# Altium schematic sheet schematic.SchDoc
size A; SheetNumber: 1; SheetTotal: 1
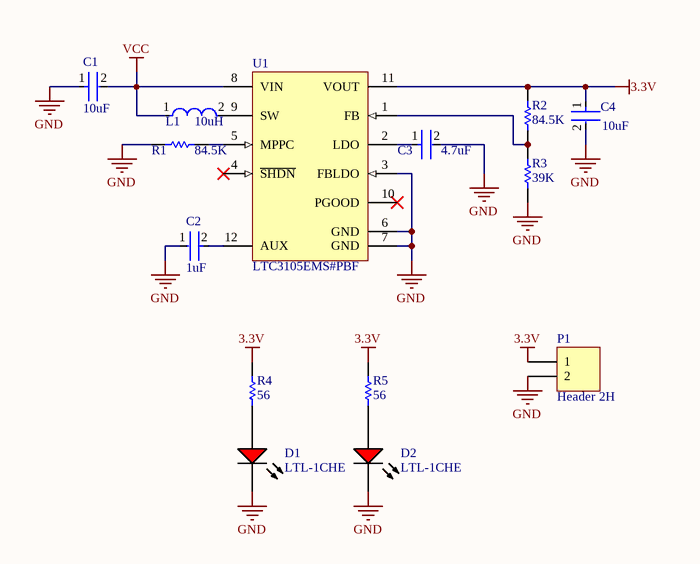
[diagram p0: schematic.SchDoc]

## Parts
C1  10uF  [FP-GRM188-0_1-e0_2_0_55-IPC_A]
C2  1uF  [FP-C1608-080-0_1-IPC_B]
C3  4.7uF  [FP-GRM188-0_15-IPC_C]
C4  10uF  [FP-GRM188-0_1-e0_2_0_55-IPC_A]
D1  LTL-1CHE  [INDPR60-254-520X380X650]
D2  LTL-1CHE  [INDPR60-254-520X380X650]
L1  10uH  [FP-NR6028-MFG]
P1  Header 2H  [HDR1X2H]
R1  84.5K  [RESC1608X55X30LL15T15]
R2  84.5K  [RESC1608X55X30LL15T15]
R3  39K  [RESC1608X55X25LL10T15]
R4  56  [RESC1608X55X30NL15T15]
R5  56  [RESC1608X55X30NL15T15]
U1  LTC3105EMS#PBF  [LT-MS-12_N]

## Nets
3.3V: C4.1 P1.1 R2.2 R4.1 R5.1 U1.11(VOUT)
GND: C1.1 C2.1 C3.2 C4.2 D1.2(K) D2.2(K) P1.2 R1.1 R3.2 U1.3(FBLDO) U1.6(GND) U1.7(GND)
VCC: C1.2 L1.1 U1.8(VIN)
NetC2_2: C2.2 U1.12(AUX)
NetC3_1: C3.1 U1.2(LDO)
NetD1_1: D1.1(A) R4.2
NetD2_1: D2.1(A) R5.2
NetL1_2: L1.2 U1.9(SW)
NetR1_2: R1.2 U1.5(MPPC)
NetR2_1: R2.1 R3.1 U1.1(FB)

Not connected (* = marked no-connect by the designer): U1 4(~{SHDN})* 10(PGOOD)*

## Library data of the parts
C1 C4 = CMP-2006-02792-2: Chip Multilayer Ceramic Capacitors for General Purpose, 0603, 10uF, X5R, 15%, 20%, 6.3V; Packaging: Tape and Reel; Voltage Rating (DC): 6.3V; Width: 0.031inch; Termination: SMD/SMT; Dielectric: X5R; Package Quantity: 4000; Voltage Rating: 6.3V; Capacitance: 10uF; Case/Package: 0603; Min Operating Temperature: -55°C; Voltage: 6.3V; Length: 1.6mm; Thickness: 0.035inch; Lead Free: Lead Free; Depth: 0.8mm; Case Code (Imperial): 0603; Max Operating Temperature: 85°C; Material: Ceramic; Height: 0.8mm; Tolerance: 20%; Mount: Surface Mount; REACH SVHC: No SVHC; Radiation Hardening: No; Case Code (Metric): 1608
C2 = CMP-2000-06025-2: Multilayer Ceramic Capacitors 1μF ±10% 50V X5R SMD 0603; Lead Free: Lead Free; Height: 0.8mm; Mount: Surface Mount; Radiation Hardening: No; Thickness: 0.035inch; Length: 1.6mm; Max Operating Temperature: 85°C; REACH SVHC: No SVHC; Min Operating Temperature: -55°C; Construction: Flat; RoHS Compliant: Yes; Voltage Rating: 50V; Dielectric: X5R; Packaging: Tape and Reel; Termination: SMD/SMT; Voltage Rating (DC): 50V; Case Code (Imperial): 0603; Voltage: 50V; Width: 0.031inch; Weight: 7.1E-05oz; Capacitance: 1uF; Depth: 0.8mm; Case Code (Metric): 1608; Series: C; Case/Package: 0603; Tolerance: 10%; Resistor Type: Ceramic; Number of Pins: 2; Dielectric Material: Ceramic; Package Quantity: 1
C3 = CMP-2006-02523-2: Chip Multilayer Ceramic Capacitors for General Purpose, 0603, 4.7uF, X5R, 15%, 10%, 25V; Case Code (Metric): 1608; Max Operating Temperature: 85°C; REACH SVHC: No SVHC; Voltage Rating: 25V; Dielectric: X5R; Packaging: Cut Tape; Width: 0.031inch; Min Operating Temperature: -55°C; Lead Free: Lead Free; Capacitance: 4.7uF; Height: 0.8mm; Case Code (Imperial): 0603; Length: 1.6mm; Voltage Rating (DC): 25V; Case/Package: 0603; Voltage: 25V; Tolerance: 10%; Thickness: 0.031inch; Mount: Surface Mount; Material: Ceramic; Package Quantity: 4000; Depth: 0.8mm
D1 D2 = CMP-1674-00005-1: Radial LED, 12.6 mcd, 20 mA, 2 V, -55 to 100 degC, 2-Pin THD, RoHS, Bulk; Shielding: Unshielded; Resistance: 0.045 Ohm; Current Rating: 3.6 A; Tolerance: 20%; PackageReference: LTL-1CHE; PackageDescription: 2-Pin Through Hole Device, Dia 3.8 mm, Pitch 2.54 mm; Case\Package: Radial; Length: 0.97 inch; Width: 0.62 inch; Height: 1.1 inch; Radiation Hardening: No; Lead Pitch: 11.44 mm; ComponentLink1URL: http://www.us.liteon.com/; ComponentLink1Description: Manufacturer URL; RoHSCompliant: true; Packaging: Tray; Mount: Through Hole; Min Operating Temperature: -40 degC; Max Operating Temperature: 130 degC; ComponentLink2URL: https://datasheet.ciiva.com/15117/getdatasheetpartid-187746-15117985.pdf; Package Quantity: 55; ComponentLink2Description: Datasheet; DatasheetVersion: Dec-03
L1 = CMP-14484-000406-1: SMD Power Inductors 10uH ±20% 1.9A 84.5mΩ; Core Material: Ferrite; Self Resonant Frequency: 20MHz; Test Frequency: 100kHz; DC Resistance (DCR): 84.5mR; Shielding: Shielded; Current Rating: 1.9A; Package Quantity: 2000; Tolerance: 20%; Saturation Current: 1.9A; Max Operating Temperature: 120°C; Case/Package: 2424; Number of Pins: 2; Lead Free: Lead Free; Series: NR; Inductance Tolerance: 20%; RMS Current (Irms): 1.9A; Max DC Current: 1.9A; Resistor Type: Wirewound; Min Operating Temperature: -25°C; Width: 6mm; Height - Seated (Max): 0.11inch; RoHS Compliant: Yes; Mount: Surface Mount; Packaging: Tape and Reel; Inductance: 10uH; Length: 0.236inch; Halogen Free: Halogen Free; Height: 2.8mm; Termination: SMD/SMT
P1 = CMP-002-000090-1: Header, 2-Pin, Right Angle; Signal Integrity: Connector; Pin Count: 2; Component Type: Standard; LatestRevisionDate: 17-Jul-2002; Design Item ID: Header 2H; LatestRevisionNote: Re-released for DXP Platform.; Source: Miscellaneous Connectors.SchLib; Publisher: Altium Limited
R1 R2 = CMP-1012-00728-2: Part Number: ERJ-3EKF8452V; Manufacturer: Panasonic
R3 = CMP-2000-06940-1: Chip Resistor, 39 KOhm, +/- 1%, 0.1 W, -55 to 155 degC, 0603 (1608 Metric), RoHS, Tape and Reel; Manufacturer: Yageo; Resistance: 39kOhms; Voltage Rating: 50V; Power Rating: 100mW; Temperature Coefficient: 100PPM/C; Product: ThickFilmResistorsGeneralPurpose; Case Code - in: 0603; Tolerance: 1%; Operating Temperature Range: -55Cto+155C; Series: RC; Package Description: 2-Pin Surface Mount Device, Body 1.6 x 0.8 mm; Datasheet URL: http://www.yageo.com/documents/recent/PYu-RC_Group_51_RoHS_L_7.pdf; Package Reference: 0603; Case Code - mm: 1608; Datasheet Version: Rev. 7, 05/2017; Mounting Technology: SurfaceMount; Packaging: Reel; Manufacturer URL: http://www.yageo.com/; Termination Style: SMD/SMT
R4 R5 = CMP-2000-00572-1: Manufacturer: Panasonic; Part Number: ERJ3EKF56R0V
U1 = CMP-0473-00104-1: 400 mA Step-Up DC/DC Converter with Maximum Power Point Control and 250 mV Start-Up, 12-pin SOP (MS-12), -40 to 85 degC, Pb-Free; Manufacturer: Linear Technology; Number of Outputs: 1; Vin Min(V): 0.225; Topology: Boost; Vin Max(V): 5; Vout Max(V): 5.25; Energy Source: Solar; Mounting Technology: Surface Mount; PackageVersion: Rev. A, 05/2013; PartNumber: LTC3105EMS#PBF; RoHS: TRUE; PackageDescription: 12-Pin Plastic MSOP, Body 4.039 x 3 mm, Pitch 0.65 mm; ComponentLink1Description: Manufacturer URL; DatasheetVersion: Rev. A; ComponentLink1URL: http://www.linear.com/; ComponentLink3Description: Package Specification; ComponentLink2URL: http://cds.linear.com/docs/en/datasheet/3105fa.pdf; ComponentLink3URL: http://cds.linear.com/docs/en/packaging/05081668_A_MS12.pdf; PackageReference: MS-12; ComponentLink2Description: Datasheet